# Altium schematic sheet 2_Sensors.SchDoc
size A4
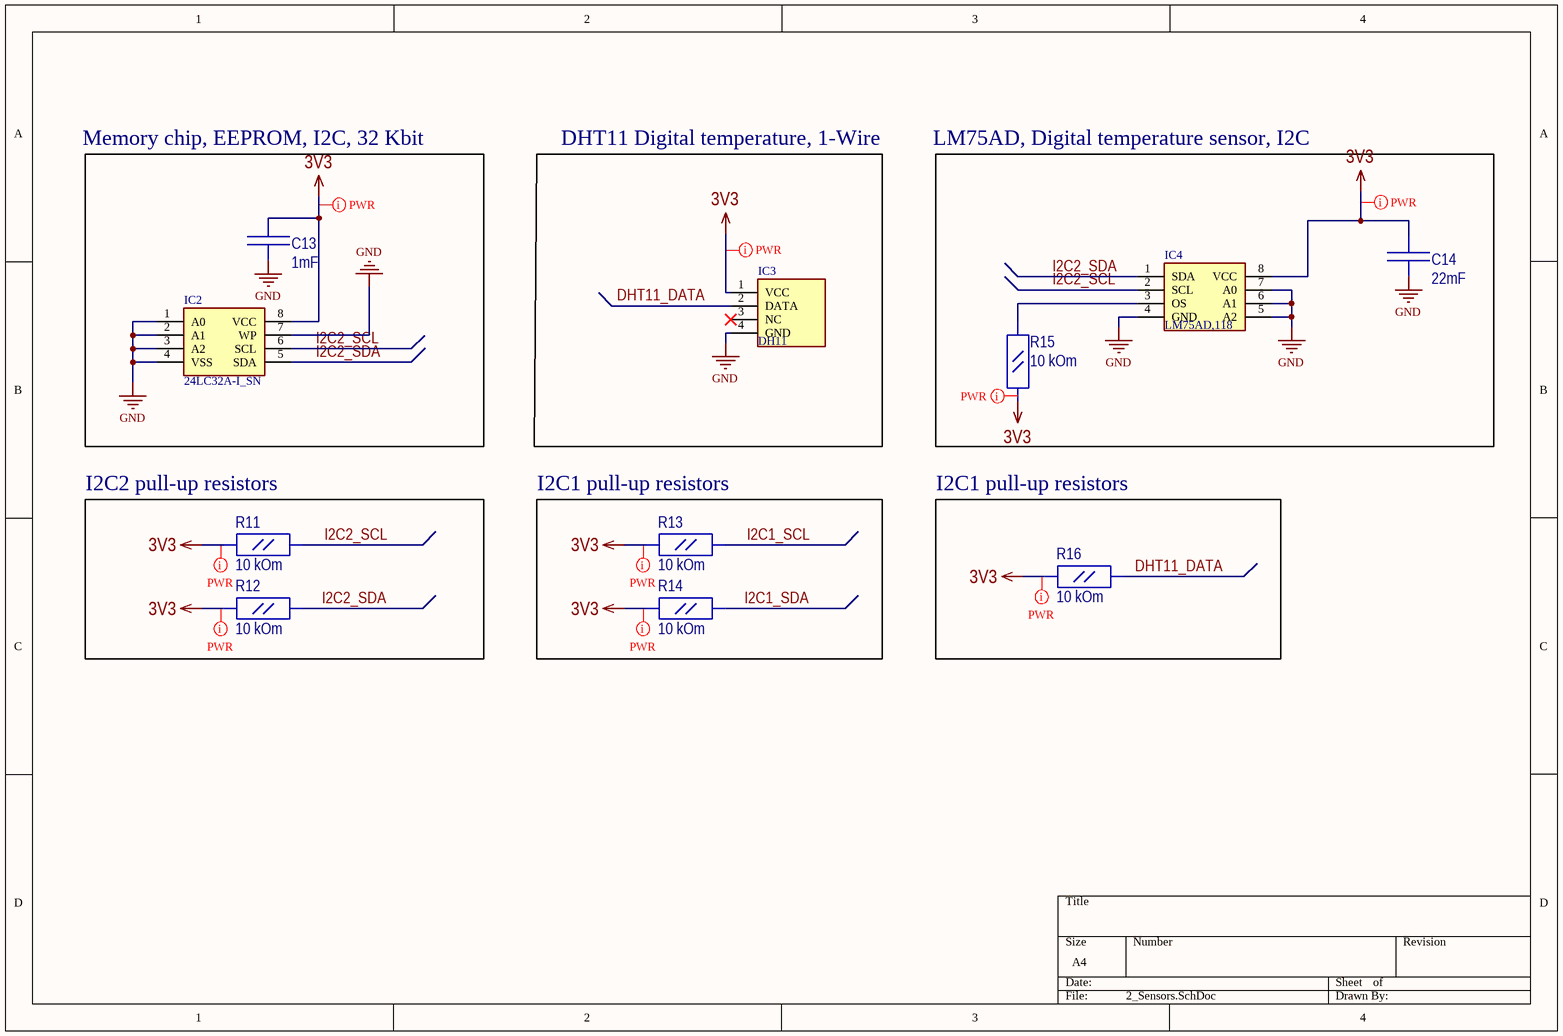
[diagram p0: 2_Sensors.SchDoc]

## Parts
C13  1mF  [C_0805]
C14  22mF  [C_0805]
IC2  24LC32A-I_SN  [SOIC127P600X175-8N]
IC3  DH11  [HDRV4W80P0X254_1X4_1200X500X1550P]
IC4  LM75AD,118  [SOIC127P600X175-8N]
R11  10 kOm  [R_0805]
R12  10 kOm  [R_0805]
R13  10 kOm  [R_0805]
R14  10 kOm  [R_0805]
R15  10 kOm  [R_0805]
R16  10 kOm  [R_0805]

## Blocks framed on the sheet
Memory chip, EEPROM, I2C, 32 Kbit: C13 IC2
DHT11 Digital temperature, 1-Wire: IC3
LM75AD, Digital temperature sensor, I2C: C14 IC4 R15
I2C2 pull-up resistors: R11 R12
I2C1 pull-up resistors: R13 R14
I2C1 pull-up resistors: R16

## Nets
3V3: C13.2 C14.2 IC2.8(VCC) IC3.1(VCC) IC4.8(VCC) R11.1 R12.1 R13.1 R14.1 R15.1 R16.1
GND: C13.1 C14.1 IC2.1(A0) IC2.2(A1) IC2.3(A2) IC2.4(VSS) IC2.7(WP) IC3.4(GND) IC4.4(GND) IC4.5(A2) IC4.6(A1) IC4.7(A0)
DHT11_DATA: IC3.2(DATA) R16.2
I2C1_SCL: R13.2
I2C1_SDA: R14.2
I2C2_SCL: IC2.6(SCL) IC4.2(SCL) R11.2
I2C2_SDA: IC2.5(SDA) IC4.1(SDA) R12.2
NetIC4_3: IC4.3(OS) R15.2

Not connected (* = marked no-connect by the designer): IC3 3(NC)*

## Layout directives
net class PWR: 3V3, (no net found under the mark)

## Library data of the parts
C13 C14 = C_0805
  C13: Value: 1mF
  C14: Value: 22mF
IC2 = 24LC32A-I_SN: Integrated Circuit; Manufacturer_Name: Microchip; Manufacturer_Part_Number: 24LC32A-I/SN; Datasheet Link: http://ww1.microchip.com/downloads/en/DeviceDoc/21713M.pdf; Height: 1.75mm; Mouser Part Number: 579-24LC32A-I/SN; Mouser Price/Stock: https://www.mouser.co.uk/ProductDetail/Microchip-Technology/24LC32A-I-SN?qs=KwArPi4cUogiVlLk9E3nOw%3D%3D; Arrow Part Number: 24LC32A-I/SN; Arrow Price/Stock: https://www.arrow.com/en/products/24lc32a-isn/microchip-technology
IC3 = 101020011: Integrated Circuit; Manufacturer_Name: Seeed Studio; Datasheet Link: https://componentsearchengine.com/Datasheets/1/101020011.pdf; Height: 15.5mm; Manufacturer_Part_Number: 101020011; Mouser Part Number: 713-101020011; Mouser Price/Stock: https://www.mouser.co.uk/ProductDetail/Seeed-Studio/101020011?qs=1%252B9yuXKSi8Dq%252B99bte6U5Q%3D%3D; Arrow Part Number: 101020011; Arrow Price/Stock: https://www.arrow.com/en/products/101020011/seeed-technology-limited
IC4 = LM75AD,118: Integrated Circuit; Manufacturer_Name: NXP; Datasheet Link: http://www.nxp.com/docs/en/data-sheet/LM75A.pdf; Height: 1.75mm; Manufacturer_Part_Number: LM75AD,118; Mouser Part Number: 771-LM75AD-T; Mouser Price/Stock: https://www.mouser.co.uk/ProductDetail/NXP-Semiconductors/LM75AD118?qs=LOCUfHb8d9tvtApDiOTqqg%3D%3D; Arrow Part Number: LM75AD,118; Arrow Price/Stock: https://www.arrow.com/en/products/lm75ad118/nxp-semiconductors?region=nac
R11-R16 = R_0805: Value: 10 kOm